# Altium schematic sheet supplies.SchDoc
size A
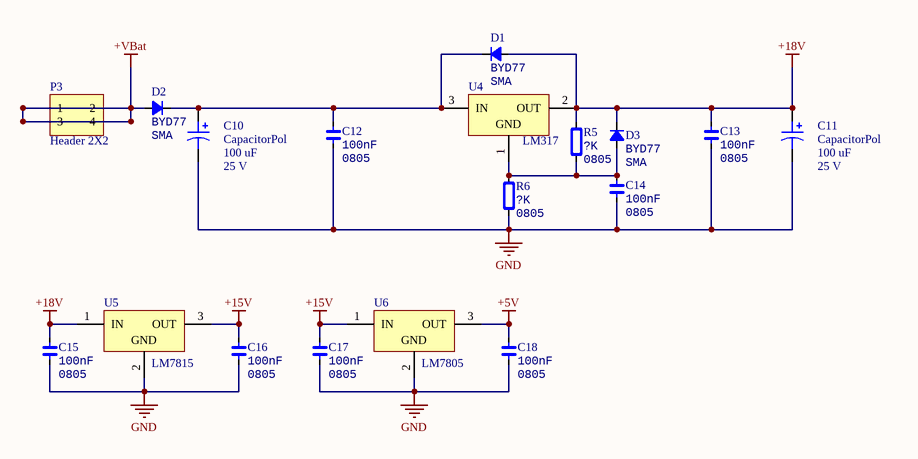
[diagram p0: supplies.SchDoc]

## Parts
C10  CapacitorPol  value 100 uF  Voltage: 25 V  [CP3.5mm-8.0mm]
C11  CapacitorPol  value 100 uF  Voltage: 25 V  [CP3.5mm-8.0mm]
C12  Type: 0805  [CAP_0805]  (hidden comment: 100nF)
C13  Type: 0805  [CAP_0805]  (hidden comment: 100nF)
C14  Type: 0805  [CAP_0805]  (hidden comment: 100nF)
C15  Type: 0805  [CAP_0805]  (hidden comment: 100nF)
C16  Type: 0805  [CAP_0805]  (hidden comment: 100nF)
C17  Type: 0805  [CAP_0805]  (hidden comment: 100nF)
C18  Type: 0805  [CAP_0805]  (hidden comment: 100nF)
D1  Type: SMA  [ST DO214AC SMA]  (hidden comment: BYD77)
D2  Type: SMA  [ST DO214AC SMA]  (hidden comment: BYD77)
D3  Type: SMA  [ST DO214AC SMA]  (hidden comment: BYD77)
P3  Header 2X2  [HDR2X2]
R5  Type: 0805  [RES 0805/2012]  (hidden comment: ?K)
R6  Type: 0805  [RES 0805/2012]  (hidden comment: ?K)
U4  LM317  [TO-220/123]
U5  LM7815  [TO-220/123]
U6  LM7805  [TO-220/123]

## Nets
+5V: C18.2 U6.3(OUT)
+15V: C16.2 C17.2 U5.3(OUT) U6.1(IN)
+18V: C11.1 C13.2 C15.2 D1.1(A) D3.2(K) R5.2 U4.2(OUT) U5.1(IN)
+VBat: D2.1(A) P3.1 P3.2 P3.3 P3.4
GND: C10.2 C11.2 C12.1 C13.1 C14.1 C15.1 C16.1 C17.1 C18.1 R6.1 U5.2(GND) U6.2(GND)
NetC10_1: C10.1 C12.2 D1.2(K) D2.2(K) U4.3(IN)
NetC14_2: C14.2 D3.1(A) R5.1 R6.2 U4.1(ADJ)

## Notes on the sheet
- (in symbol L7805ACV) GND

## Library data of the parts
C10 C11 = CapacitorPol: Solid Aluminum Capacitor with Organic Semiconductor Electrolyte: 100uF, 10V, Bulk Pack; Note: Part Numbers shown are for ± 20% capacitance tolerance (X0).; PCB_Layout: Complies with Manufacturer's Recommendation.; DrillSize: Nominal, Rounded to the nearest 0.1mm; Published: 19-Mar-2004; DatasheetDocument: 29-Jun-2001; PackageReference: E; Publisher: Altium Limited; ComponentLink1Description: Manufacturer Link; ComponentLink1URL: http://www.vishay.com/; ComponentLink2Description: Datasheet; ComponentLink2URL: http://www.vishay.com/docs/90003/94sa.pdf
C12-C18 = Cap_0805: Capacitor; Value: 100nF
D1-D3 = Diode_SMA: Diode; Value: BYD77
P3 = Header 2X2: Header, 2-Pin, Dual row; LatestRevisionDate: 17-Jul-2002; LatestRevisionNote: Re-released for DXP Platform.; Publisher: Altium Limited
R5 R6 = Res_0805: Resistor; Value: ?K
U4 = L7805ACV: Precision 1A Regulator; Note: Tab is connected to pin 3 (GND).; value: LT783; Published: 24-Aug-2001; LatestRevisionDate: 17-Jul-2002; LatestRevisionNote: Re-released for DXP Platform.; DatasheetVersion: Nov-1999; PackageVersion: Jun-1998; PackageReference: TO220ABN; Publisher: Altium Limited; PackageDescription: TO, Thru-Hole, Vertical, Heatsink Mounted; 3 In-Line Leads; Pitch 2.54 mm; Pin sequence 1, 3, 2; ComponentLink1Description: Manufacturer Link; ComponentLink1URL: http://www.st.com/; ComponentLink2Description: Datasheet; ComponentLink2URL: http://www.st.com/stonline/products/literature/ds/2144/l7805ab.pdf
U5 U6 = µA7805CKC: Positive-Voltage Regulator; Note: Pin 2 is electrically connected to TAB.; Published: 15-Apr-2002; DatasheetVersion: Jul-1999; PackageVersion: Sep-1995; PackageReference: KC03; Publisher: Altium Limited; PackageDescription: TO, Thru-Hole, Vertical, Heatsink Mounted; 3 In-Line Leads; Pitch 2.54 mm; ComponentLink1Description: Manufacturer Link; ComponentLink1URL: http://www.ti.com/; ComponentLink2Description: Datasheet; ComponentLink2URL: http://www-s.ti.com/sc/ds/ua7805.pdf